# Altium project bga_fast_v2.0.PrjPcb (part 2 of 2)

## Sheet power.SchDoc
size A4; SheetNumber: 5; SheetTotal: 7
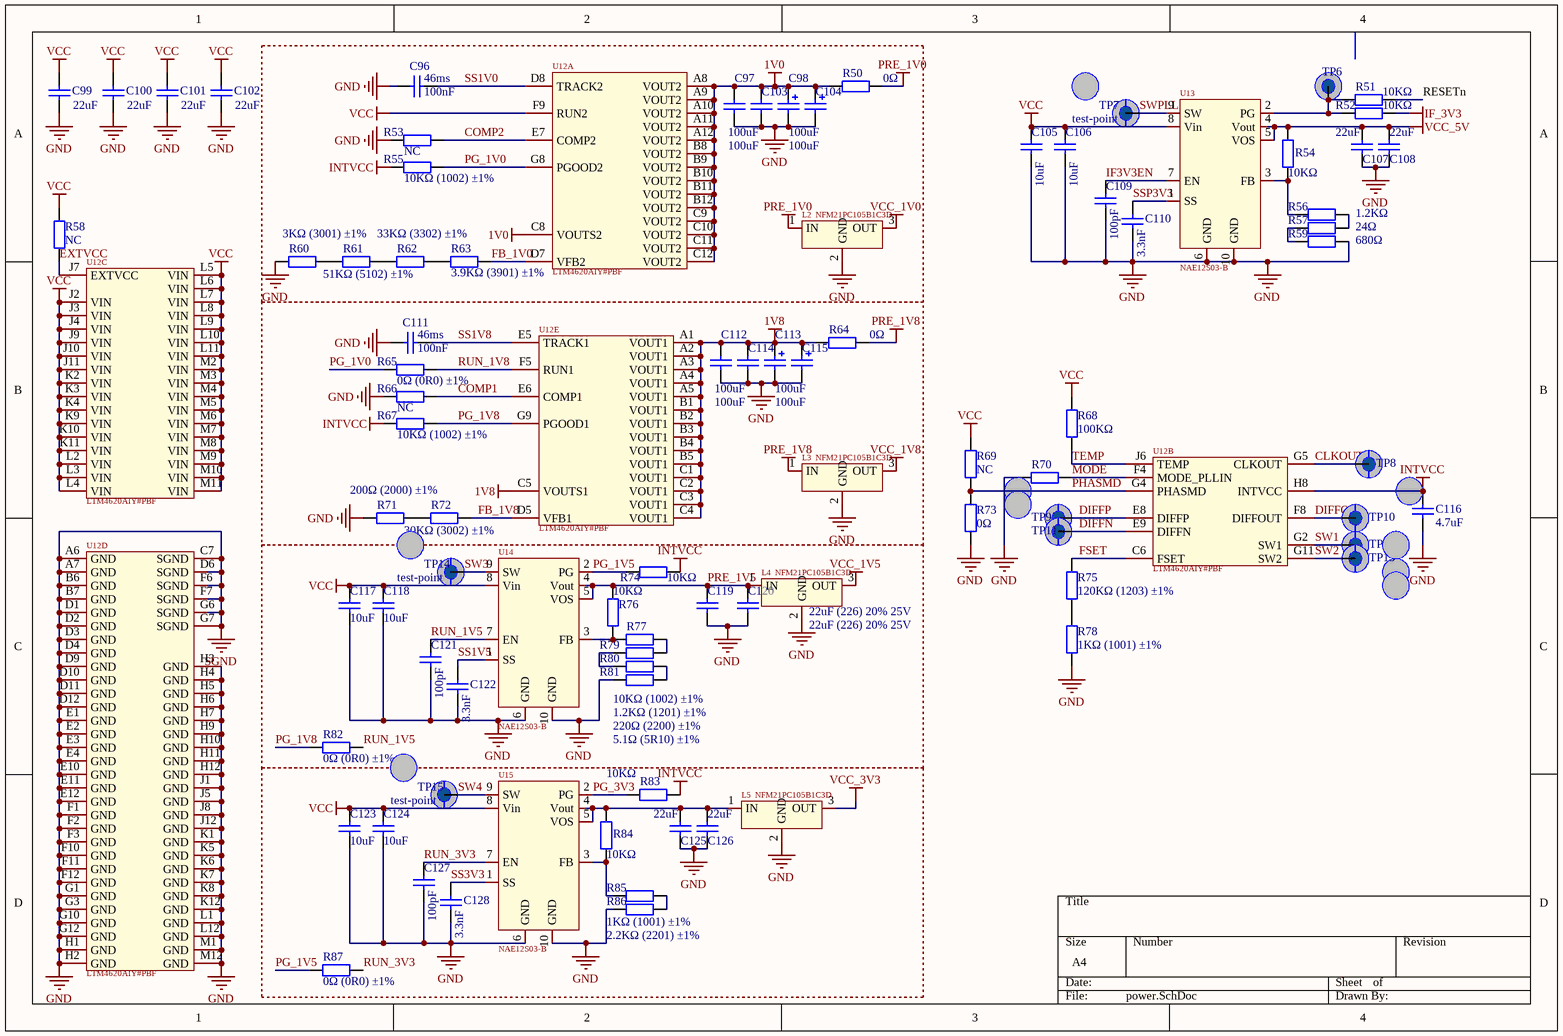
[diagram p5: power.SchDoc]

### Parts
C96  100nF  [0805_C]
C97  100uF  [1206_C]
C98  100uF  [CASE-B_3528]
C99  22uF  [0805_C]
C100  22uF  [0805_C]
C101  22uF  [0805_C]
C102  22uF  [0805_C]
C103  100uF  [1206_C]
C104  100uF  [CASE-B_3528]
C105  10uF  [0805_C]
C106  10uF  [0805_C]
C107  22uF  [0805_C]
C108  22uF  [0805_C]
C109  100pF  [0805_C]
C110  3.3nF  [0805_C]
C111  100nF  [0805_C]
C112  100uF  [1206_C]
C113  100uF  [CASE-B_3528]
C114  100uF  [1206_C]
C115  100uF  [CASE-B_3528]
C116  4.7uF  [0805_C]
C117  10uF  [0805_C]
C118  10uF  [0805_C]
C119  22uF (226) 20% 25V  [0805_C]
C120  22uF (226) 20% 25V  [0805_C]
C121  100pF  [0805_C]
C122  3.3nF  [0805_C]
C123  10uF  [0805_C]
C124  10uF  [0805_C]
C125  22uF  [0805_C]
C126  22uF  [0805_C]
C127  100pF  [0805_C]
C128  3.3nF  [0805_C]
L2  NFM21PC105B1C3D  [FILTER-SMD_3P-L2.0-W1.2-L]
L3  NFM21PC105B1C3D  [FILTER-SMD_3P-L2.0-W1.2-L]
L4  NFM21PC105B1C3D  [FILTER-SMD_3P-L2.0-W1.2-L]
L5  NFM21PC105B1C3D  [FILTER-SMD_3P-L2.0-W1.2-L]
R50  0Ω  [0402_R]
R51  10KΩ  [0805_R]
R52  10KΩ  [0805_R]
R53  NC  [0805_R]
R54  10KΩ  [0805_R]
R55  10KΩ (1002) ±1%  [0805_R]
R56  1.2KΩ  [0805_R]
R57  24Ω  [0805_R]
R58  NC  [0805_R]
R59  680Ω  [0805_R]
R60  3KΩ (3001) ±1%  [0805_R]
R61  51KΩ (5102) ±1%  [0805_R]
R62  33KΩ (3302) ±1%  [0805_R]
R63  3.9KΩ (3901) ±1%  [0805_R]
R64  0Ω  [0402_R]
R65  0Ω (0R0) ±1%  [0805_R]
R66  NC  [0805_R]
R67  10KΩ (1002) ±1%  [0805_R]
R68  100KΩ  [0805_R]
R69  NC  [0805_R]
R70  0Ω  [0805_R]
R71  200Ω (2000) ±1%  [0805_R]
R72  30KΩ (3002) ±1%  [0805_R]
R73  0Ω  [0805_R]
R74  10KΩ  [0805_R]
R75  120KΩ (1203) ±1%  [0805_R]
R76  10KΩ  [0805_R]
R77  10KΩ (1002) ±1%  [0805_R]
R78  1KΩ (1001) ±1%  [0805_R]
R79  1.2KΩ (1201) ±1%  [0805_R]
R80  220Ω (2200) ±1%  [0805_R]
R81  5.1Ω (5R10) ±1%  [0805_R]
R82  0Ω (0R0) ±1%  [0805_R]
R83  10KΩ  [0805_R]
R84  10KΩ  [0805_R]
R85  2.2KΩ (2201) ±1%  [0805_R]
R86  1KΩ (1001) ±1%  [0805_R]
R87  0Ω (0R0) ±1%  [0805_R]
TP6  test-point  [POINT]  (value not drawn)
TP7  test-point  [POINT]
TP8  test-point  [POINT]  (value not drawn)
TP9  test-point  [POINT]  (value not drawn)
TP10  test-point  [POINT]  (value not drawn)
TP11  test-point  [POINT]  (value not drawn)
TP12  test-point  [POINT]  (value not drawn)
TP13  test-point  [POINT]  (value not drawn)
TP14  test-point  [POINT]
TP15  test-point  [POINT]
U12  LTM4620AIY#PBF  [BGA-144_L15.0-W15.0-R12-C12-P1.27-BL]  (parts A,B,C,D,E of 5)
U13  NAE12S03-B  [PWRM-SMD_HUAWEI_NAE12S03]
U14  NAE12S03-B  [PWRM-SMD_HUAWEI_NAE12S03]
U15  NAE12S03-B  [PWRM-SMD_HUAWEI_NAE12S03]

### Blocks framed on the sheet
46ms: C96-C98 C103 C104 L2 R50 R53 R55 R60-R63 U12
46ms: C111-C115 L3 R64-R67 R71 R72 U12

### Nets
1V0: C97.2 C98.1 C103.2 C104.1 R50.1 U12.A8(VOUT2) U12.A9(VOUT2) U12.A10(VOUT2) U12.A11(VOUT2) U12.A12(VOUT2) U12.B8(VOUT2) U12.B9(VOUT2) U12.B10(VOUT2) U12.B11(VOUT2) U12.B12(VOUT2) U12.C8(VOUTS2) U12.C9(VOUT2) U12.C10(VOUT2) U12.C11(VOUT2) U12.C12(VOUT2)
1V8: C112.2 C113.1 C114.2 C115.1 R64.1 U12.A1(VOUT1) U12.A2(VOUT1) U12.A3(VOUT1) U12.A4(VOUT1) U12.A5(VOUT1) U12.B1(VOUT1) U12.B2(VOUT1) U12.B3(VOUT1) U12.B4(VOUT1) U12.B5(VOUT1) U12.C1(VOUT1) U12.C2(VOUT1) U12.C3(VOUT1) U12.C4(VOUT1) U12.C5(VOUTS1)
GND: C96.2 C97.1 C98.2 C99.1 C100.1 C101.1 C102.1 C103.1 C104.2 C105.1 C106.1 C107.1 C108.1 C109.1 C110.1 C111.2 C112.1 C113.2 C114.1 C115.2 C116.1 C117.1 C118.1 C119.1 C120.1 C121.1 C122.1 C123.1 C124.1 C125.1 C126.1 C127.1 C128.1 L2.2(GND) L3.2(GND) L4.2(GND) L5.2(GND) R53.1 R59.2 R60.2 R66.1 R70.2 R71.1 R73.1 R78.1 R81.2 R86.2 U12.A6(GND) U12.A7(GND) U12.B6(GND) U12.B7(GND) U12.C7(SGND) U12.D1(GND) U12.D2(GND) U12.D3(GND) U12.D4(GND) U12.D6(SGND) U12.D9(GND) U12.D10(GND) U12.D11(GND) U12.D12(GND) U12.E1(GND) U12.E2(GND) U12.E3(GND) U12.E4(GND) U12.E10(GND) U12.E11(GND) U12.E12(GND) U12.F1(GND) U12.F2(GND) U12.F3(GND) U12.F6(SGND) U12.F7(SGND) U12.F10(GND) U12.F11(GND) U12.F12(GND) U12.G1(GND) U12.G3(GND) U12.G6(SGND) U12.G7(SGND) U12.G10(GND) U12.G12(GND) U12.H1(GND) U12.H2(GND) U12.H3(GND) U12.H4(GND) U12.H5(GND) U12.H6(GND) U12.H7(GND) U12.H9(GND) U12.H10(GND) U12.H11(GND) U12.H12(GND) U12.J1(GND) U12.J5(GND) U12.J8(GND) U12.J12(GND) U12.K1(GND) U12.K5(GND) U12.K6(GND) U12.K7(GND) U12.K8(GND) U12.K12(GND) U12.L1(GND) U12.L12(GND) U12.M1(GND) U12.M12(GND) U13.6(GND) U13.10(GND) U14.6(GND) U14.10(GND) U15.6(GND) U15.10(GND)  [also labelled SGND]
IF_3V3: R52.1
INTVCC: C116.2 R55.2 R67.2 R74.2 R83.2 U12.H8(INTVCC)
PRE_1V0: L2.1(IN) R50.2
PRE_1V8: L3.1(IN) R64.2
VCC: C99.2 C100.2 C101.2 C102.2 C105.2 C106.2 C117.2 C118.2 C123.2 C124.2 R58.1 R68.2 R69.2 U12.F9(RUN2) U12.J2(VIN) U12.J3(VIN) U12.J4(VIN) U12.J9(VIN) U12.J10(VIN) U12.J11(VIN) U12.K2(VIN) U12.K3(VIN) U12.K4(VIN) U12.K9(VIN) U12.K10(VIN) U12.K11(VIN) U12.L2(VIN) U12.L3(VIN) U12.L4(VIN) U12.L5(VIN) U12.L6(VIN) U12.L7(VIN) U12.L8(VIN) U12.L9(VIN) U12.L10(VIN) U12.L11(VIN) U12.M2(VIN) U12.M3(VIN) U12.M4(VIN) U12.M5(VIN) U12.M6(VIN) U12.M7(VIN) U12.M8(VIN) U12.M9(VIN) U12.M10(VIN) U12.M11(VIN) U13.8(Vin) U14.8(Vin) U15.8(Vin)
VCC_1V0: L2.3(OUT)
VCC_1V5: L4.3(OUT)
VCC_1V8: L3.3(OUT)
VCC_3V3: L5.3(OUT)
VCC_5V: C107.2 C108.2 R54.2 U13.4(Vout) U13.5(VOS)
CLKOUT: TP8.1(point) U12.G5(CLKOUT)
COMP1: R66.2 U12.E6(COMP1)
COMP2: R53.2 U12.E7(COMP2)
DIFFN: TP11.1(point) U12.E9(DIFFN)
DIFFO: TP10.1(point) U12.F8(DIFFOUT)
DIFFP: TP9.1(point) U12.E8(DIFFP)
EXTVCC: R58.2 U12.J7(EXTVCC)
FB_1V0: R63.2 U12.D7(VFB2)
FB_1V8: R72.2 U12.D5(VFB1)
FSET: R75.2 U12.C6(FSET)
IF3V3EN: C109.2 U13.7(EN)
MODE: R70.1 U12.F4(MODE_PLLIN)
PG_1V0: R55.1 R65.2 U12.G8(PGOOD2)
PG_1V5: R74.1 R87.2 U14.2(PG)
PG_1V8: R67.1 R82.2 U12.G9(PGOOD1)
PG_3V3: R83.1 U15.2(PG)
PHASMD: R69.1 R73.2 U12.G4(PHASMD)
PRE_1V5: C119.2 C120.2 L4.1(IN) R76.2 U14.4(Vout) U14.5(VOS)
RESETn: R51.1
RUN_1V5: C121.2 R82.1 U14.7(EN)
RUN_1V8: R65.1 U12.F5(RUN1)
RUN_3V3: C127.2 R87.1 U15.7(EN)
SS1V0: C96.1 U12.D8(TRACK2)
SS1V5: C122.2 U14.1(SS)
SS1V8: C111.1 U12.E5(TRACK1)
SS3V3: C128.2 U15.1(SS)
SSP3V3: C110.2 U13.1(SS)
SW1: TP12.1(point) U12.G2(SW1)
SW2: TP13.1(point) U12.G11(SW2)
SW3: TP14.1(point) U14.9(SW)
SW4: TP15.1(point) U15.9(SW)
SWPLL: TP7.1(point) U13.9(SW)
TEMP: R68.1 U12.J6(TEMP)
NetC125_2: C125.2 C126.2 L5.1(IN) R84.2 U15.4(Vout) U15.5(VOS)
NetR51_2: R51.2 R52.2 TP6.1(point) U13.2(PG)
NetR54_1: R54.1 R56.1 U13.3(FB)
NetR56_2: R56.2 R57.2
NetR57_1: R57.1 R59.1
NetR60_1: R60.1 R61.1
NetR61_2: R61.2 R62.1
NetR62_2: R62.2 R63.1
NetR71_2: R71.2 R72.1
NetR75_1: R75.1 R78.2
NetR76_1: R76.1 R77.1 U14.3(FB)
NetR77_2: R77.2 R79.1
NetR79_2: R79.2 R80.2
NetR80_1: R80.1 R81.1
NetR84_1: R84.1 R85.1 U15.3(FB)
NetR85_2: R85.2 R86.1

### Library data of the parts
C96 C111 = 0805 100nF(104) 10% 50V: 贴片电容; ComponentLink1Description: 供应商链接; ComponentLink1URL: http://www.szlcsc.com/product/details_50686.html; Package: 0805; Supplier: LC; SuppliersPartNumber: C49678
C97 C103 C112 C114 = 1206 100nF (104) 10% 50V: 贴片电容; ComponentLink1Description: 供应商链接; ComponentLink1URL: http://www.szlcsc.com/product/details_25237.html; Package: 1206; Supplier: LC; SuppliersPartNumber: C24497
C98 C104 C113 C115 = 3528 100uF (107) 10% 6.3V: 钽电容; ComponentLink1Description: 供应商链接; ComponentLink1URL: http://www.szlcsc.com/product/details_16815.html; Package: 3528; Supplier: LC; SuppliersPartNumber: C16133
C99-C102 C107 C108 C119 C120 C125 C126 = 0805 22uF (226) 20% 25V: 贴片电容; ComponentLink1Description: 供应商链接; ComponentLink1URL: http://www.szlcsc.com/product/details_46786.html; Package: 0805; Supplier: LC; SuppliersPartNumber: C45783
C105 C106 C117 C118 C123 C124 = 0805 10uF (106) 10% 25V: 贴片电容; ComponentLink1Description: 供应商链接; ComponentLink1URL: http://www.szlcsc.com/product/details_16532.html; Package: 0805; Supplier: LC; SuppliersPartNumber: C15850
C109 C121 C127 = 0805 100pF (101) 5% 50V: 贴片电容; ComponentLink1Description: 供应商链接; ComponentLink1URL: http://www.szlcsc.com/product/details_2142.html; Package: 0805; Supplier: LC; SuppliersPartNumber: C1790
C110 C122 C128 = 0805 3.3nF (332) 10% 50V: 贴片电容; ComponentLink1Description: 供应商链接; ComponentLink1URL: http://www.szlcsc.com/product/details_54191.html; Package: 0805; Supplier: LC; SuppliersPartNumber: C53175
C116 = 0805 4.7uF (475) 10% 25V: 贴片电容; ComponentLink1Description: 供应商链接; ComponentLink1URL: http://www.szlcsc.com/product/details_2131.html; Package: 0805; Supplier: LC; SuppliersPartNumber: C1779
L2-L5 = NFM21PC105B1C3D: 穿心电容; Manufacturer: muRata(村田); Add into BOM: yes; Nominal Capacitance: 1uF; CapacitanceTolerance: ±20%; DC Rated Voltage: 16V; Rated Current: 4A; DC Resistance: 20mΩ; Symbol: NFM21PC105B1C3D; Device: NFM21PC105B1C3D; LCSC Part Name: 1.0uF(105) ±20%16V; Supplier Part: C92518; Manufacturer Part: NFM21PC105B1C3D; Supplier Footprint: SMD-3P,1.2x2mm; JLCPCB Part Class: Extended Part; Datasheet: https://atta.szlcsc.com/upload/public/pdf/source/20170105/1483610797228.pdf; Supplier: LCSC; Convert to PCB: yes; Operating Temperature: -40℃~+85℃
R50 R64 R65 R69 R70 R73 R82 R87 = 0805 0Ω (0R0) 1%: 贴片电阻; ComponentLink1Description: 供应商链接; ComponentLink1URL: http://www.szlcsc.com/product/details_18165.html; Package: 0805; Supplier: LC; SuppliersPartNumber: C17477
R51 R52 R54 R55 R67 R74 R76 R77 R83 R84 = 0805 10KΩ (1002) 1%: 贴片电阻; ComponentLink1Description: 供应商链接; ComponentLink1URL: http://www.szlcsc.com/product/details_18102.html; Package: 0805; Supplier: LC; SuppliersPartNumber: C17414
R53 R62 R66 R72 = 0805 33KΩ (3302) 1%: 贴片电阻; ComponentLink1Description: 供应商链接; ComponentLink1URL: http://www.szlcsc.com/product/details_18321.html; Package: 0805; Supplier: LC; SuppliersPartNumber: C17633
R56 R85 = 0805 2.2KΩ (2201) 1%: 贴片电阻; ComponentLink1Description: 供应商链接; ComponentLink1URL: http://www.szlcsc.com/product/details_18208.html; Package: 0805; Supplier: LC; SuppliersPartNumber: C17520
R57 R59 R86 = 0805 1KΩ (1001) 1%: 贴片电阻; ComponentLink1Description: 供应商链接; ComponentLink1URL: http://www.szlcsc.com/product/details_18201.html; Package: 0805; Supplier: LC; SuppliersPartNumber: C17513
R58 R60 = 0805 3KΩ (3001) 1%: 贴片电阻; ComponentLink1Description: 供应商链接; ComponentLink1URL: http://www.szlcsc.com/product/details_18349.html; Package: 0805; Supplier: LC; SuppliersPartNumber: C17661
R61 = 0805 51KΩ (5102) 1%: 贴片电阻; ComponentLink1Description: 供应商链接; ComponentLink1URL: http://www.szlcsc.com/product/details_18425.html; Package: 0805; Supplier: LC; SuppliersPartNumber: C17737
R63 = 0805 3.9KΩ (3901) 1%: 贴片电阻; ComponentLink1Description: 供应商链接; ComponentLink1URL: http://www.szlcsc.com/product/details_18302.html; Package: 0805; Supplier: LC; SuppliersPartNumber: C17614
R68 = 0805 100KΩ (1003) 1%: 贴片电阻; ComponentLink1Description: 供应商链接; ComponentLink1URL: http://www.szlcsc.com/product/details_18095.html; Package: 0805; Supplier: LC; SuppliersPartNumber: C17407
R71 = 0805 200Ω (2000) 1%: 贴片电阻; ComponentLink1Description: 供应商链接; ComponentLink1URL: http://www.szlcsc.com/product/details_18228.html; Package: 0805; Supplier: LC; SuppliersPartNumber: C17540
R75 = 0402 120KΩ (1203) 1%: 贴片电阻; ComponentLink1Description: 供应商链接; ComponentLink1URL: http://www.szlcsc.com/product/details_26493.html; Package: 0402; Supplier: LC; SuppliersPartNumber: C25750
R78 = 0402 1KΩ (1001) 1%: 贴片电阻; ComponentLink1Description: 供应商链接; ComponentLink1URL: http://www.szlcsc.com/product/details_12256.html; Package: 0402; Supplier: LC; SuppliersPartNumber: C11702
R79 = 0805 1.2KΩ (1201) 1%: 贴片电阻; ComponentLink1Description: 供应商链接; ComponentLink1URL: http://www.szlcsc.com/product/details_18067.html; Package: 0805; Supplier: LC; SuppliersPartNumber: C17379
R80 = 0805 220Ω (2200) 1%: 贴片电阻; ComponentLink1Description: 供应商链接; ComponentLink1URL: http://www.szlcsc.com/product/details_18245.html; Package: 0805; Supplier: LC; SuppliersPartNumber: C17557
R81 = 0805 5.1Ω (5R10) 1%: 贴片电阻; ComponentLink1Description: 供应商链接; ComponentLink1URL: http://www.szlcsc.com/product/details_18412.html; Package: 0805; Supplier: LC; SuppliersPartNumber: C17724
TP6-TP15 = test-point: 测试点
U12 = LTM4620AIY#PBF: ADI电源; Manufacturer: ADI(亚德诺); Add into BOM: yes; Conversion Type: DC-DC; Input Voltage(DC): 4.5V~16V; Output Voltage: 0.6V~5.3V; Output Current (Max): 13A; Output Channel: 2; Symbol: LTM4620AIY#PBF; Device: LTM4620AIY#PBF; LCSC Part Name: 双通道 13A 或单通道 26A DC/DC uModule 稳压器; Supplier Part: C108015; Manufacturer Part: LTM4620AIY#PBF; Supplier Footprint: BGA-144(15x15); JLCPCB Part Class: Extended Part; Datasheet: https://atta.szlcsc.com/upload/public/pdf/source/20191223/C471410_9980ECA8DA2BC0F921CA49592D580556.pdf; Supplier: LCSC; Convert to PCB: yes; Output Power: -; Insulated Voltage: -; Conversion Efficiency: -; Feature: 过压保护；欠压保护；过流保护; Maximum Capacitive Load: -
U13-U15 = NAE12S03-B: 华为电源模块; Manufacturer: HUAWEI(华为); Add into BOM: yes; Conversion Type: DC-DC; Input Voltage(DC): 6.3V~14V; Output Voltage: 0.8V~5.2V; Output Power: 15W; Output Current (Max): 3A; Output Channel: 1; Maximum Capacitive Load: 500uF; Symbol: NAE12S03-B; Device: NAE12S03-B; LCSC Part Name: NAE12S03-B; Supplier Part: C5632472; Manufacturer Part: NAE12S03-B; Supplier Footprint: -; JLCPCB Part Class: Extended Part; Datasheet: https://atta.szlcsc.com/upload/public/pdf/source/20230428/342BA0ED97D448F86BA8DB326342F56D.pdf; Supplier: LCSC; Convert to PCB: yes

## Sheet Risc_V.SchDoc
size A4; SheetNumber: 6; SheetTotal: 7
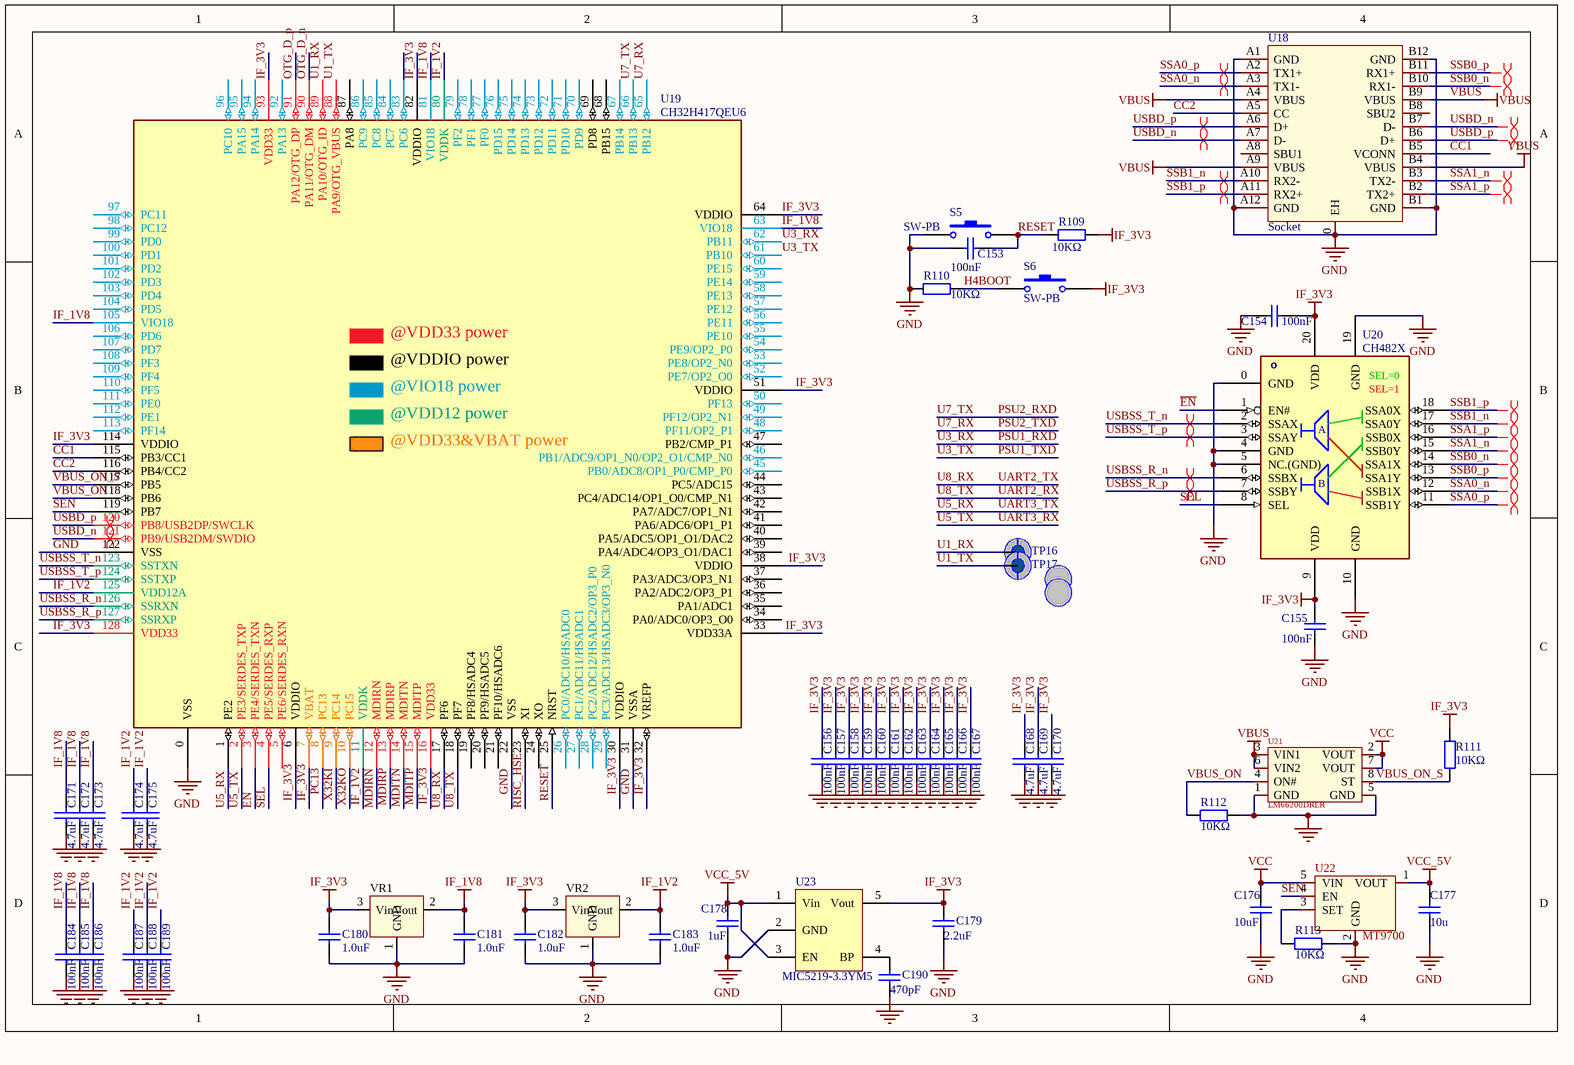
[diagram p6: Risc_V.SchDoc]

### Parts
C153  100nF  [0805_C]
C154  100nF  [0201]
C155  100nF  [0201]
C156  100nF  [0201]
C157  100nF  [0201]
C158  100nF  [0201]
C159  100nF  [0201]
C160  100nF  [0201]
C161  100nF  [0201]
C162  100nF  [0201]
C163  100nF  [0201]
C164  100nF  [0201]
C165  100nF  [0201]
C166  100nF  [0201]
C167  100nF  [0201]
C168  4.7uF  [0805_C]
C169  4.7uF  [0805_C]
C170  4.7uF  [0805_C]
C171  4.7uF  [0805_C]
C172  4.7uF  [0805_C]
C173  4.7uF  [0805_C]
C174  4.7uF  [0805_C]
C175  4.7uF  [0805_C]
C176  10uF  [0805_C]
C177  10u  [0805_C]
C178  1uF  [0805_C]
C179  2.2uF  [0805_C]
C180  1.0uF  [0805_C]
C181  1.0uF  [0805_C]
C182  1.0uF  [0805_C]
C183  1.0uF  [0805_C]
C184  100nF  [0201]
C185  100nF  [0201]
C186  100nF  [0201]
C187  100nF  [0201]
C188  100nF  [0201]
C189  100nF  [0201]
C190  470pF  [0805_C]
R109  10KΩ  [0805_R]
R110  10KΩ  [0805_R]
R111  10KΩ  [0805_R]
R112  10KΩ  [0201]
R113  10KΩ  [0805_R]
S5  SW-PB  [SW-3*4-2P]
S6  SW-PB  [SW-3*4-2P]
TP16  test-point  [POINT]  (value not drawn)
TP17  test-point  [POINT]  (value not drawn)
U18  Socket  [USB Type C 24pin全后贴]
U19  CH32H417QEU6  [QFN128_12.3X12.3]
U20  CH482X  [QFN20_2.5X4.5]
U21  LM66200DRLR  [SOT-583-8_L2.1-W1.2-P0.50-LS1.6-BL]
U22  MT9700  [SOT-23-5]
U23  MIC5219-3.3YM5  [SOT-23-5]
VR1  XC6206P332MR-G  [SOT-23-3_L2.9-W1.6-P1.90-LS2.8-BR]  (value not drawn)
VR2  XC6206P332MR-G  [SOT-23-3_L2.9-W1.6-P1.90-LS2.8-BR]  (value not drawn)

### Nets
GND: C153.1 C154.2 C155.1 C156.2 C157.1 C158.2 C159.2 C160.1 C161.2 C162.1 C163.2 C164.2 C165.1 C166.1 C167.1 C168.2 C169.2 C170.2 C171.2 C172.1 C173.2 C174.2 C175.1 C176.1 C177.1 C178.1 C179.1 C180.1 C181.1 C182.1 C183.1 C184.1 C185.1 C186.2 C187.1 C188.1 C189.1 C190.1 R110.1 R112.1 R113.1 S5.1 U18.0(EH) U18.A1(GND) U18.A12(GND) U18.B1(GND) U18.B12(GND) U19.0(VSS) U19.22(VSS) U19.31(VSSA) U19.122(VSS) U20.0(GND) U20.4(GND) U20.5(NC.(GND)) U20.10(GND) U20.19(GND) U21.1(GND) U21.5(GND) U22.2(GND) U23.2(GND) VR1.1(GND) VR2.1(GND)
IF_1V2: C174.1 C175.2 C183.2 C187.2 C188.2 C189.2 U19.11(VDDK) U19.80(VDDK) U19.125(VDD12A) VR2.2(Vout)
IF_1V8: C171.1 C172.2 C173.1 C181.2 C184.2 C185.2 C186.1 U19.63(VIO18) U19.81(VIO18) U19.105(VIO18) VR1.2(Vout)
IF_3V3: C154.1 C155.2 C156.1 C157.2 C158.1 C159.1 C160.2 C161.1 C162.2 C163.1 C164.1 C165.2 C166.2 C167.2 C168.1 C169.1 C170.1 C179.2 C180.2 C182.2 R109.2 R111.2 S6.2 U19.6(VDDIO) U19.7(VBAT) U19.16(VDD33) U19.30(VDDIO) U19.32(VREFP) U19.33(VDD33A) U19.38(VDDIO) U19.51(VDDIO) U19.64(VDDIO) U19.82(VDDIO) U19.93(VDD33) U19.114(VDDIO) U19.128(VDD33) U20.9(VDD) U20.20(VDD) U23.5(Vout) VR1.3(Vin) VR2.3(Vin)
VBUS: U18.A4(VBUS) U18.A9(VBUS) U18.B4(VBUS) U18.B9(VBUS) U21.3(VIN1) U21.6(VIN2)
VCC: C176.2 U21.2(VOUT) U21.7(VOUT) U22.5(VIN)
VCC_5V: C177.2 C178.2 U22.1(VOUT) U23.1(Vin) U23.3(EN)
CC1: U18.B5(VCONN) U19.115(PB3/CC1)
CC2: U18.A5(CC) U19.116(PB4/CC2)
~{EN}: U19.3(PE4/SERDES_TXN) U20.1(EN#)
H4BOOT: R110.2 S6.1
MDIRN: U19.12(MDIRN)
MDIRP: U19.13(MDIRP)
MDITN: U19.14(MDITN)
MDITP: U19.15(MDITP)
OTG_D_n: U19.90(PA11/OTG_DM)
OTG_D_p: U19.91(PA12/OTG_DP)
PC13: U19.8(PC13)
PSU1_RXD: U19.62(PB11)  [also labelled U3_RX]
PSU1_TXD: U19.61(PB10)  [also labelled U3_TX]
PSU2_RXD: U19.66(PB13)  [also labelled U7_TX]
PSU2_TXD: U19.65(PB12)  [also labelled U7_RX]
RESET: C153.2 R109.1 S5.2 U19.25(NRST)
RISC_HSE: U19.23(XI)
SEL: U19.4(PE5/SERDES_RXP) U20.8(SEL)
SEN: U19.119(PB7) U22.4(EN)
SSA0_n: U18.A3(TX1-) U20.12(SSB1X)
SSA0_p: U18.A2(TX1+) U20.11(SSB1Y)
SSA1_n: U18.B3(TX2-) U20.15(SSB0Y)
SSA1_p: U18.B2(TX2+) U20.16(SSB0X)
SSB0_n: U18.B10(RX1-) U20.14(SSA1X)
SSB0_p: U18.B11(RX1+) U20.13(SSA1Y)
SSB1_n: U18.A10(RX2-) U20.17(SSA0Y)
SSB1_p: U18.A11(RX2+) U20.18(SSA0X)
U1_RX: TP16.1(point) U19.89(PA10/OTG_ID)
U1_TX: TP17.1(point) U19.88(PA9/OTG_VBUS)
U5_RX: U19.1(PE2)  [also labelled UART3_TX]
U5_TX: U19.2(PE3/SERDES_TXP)  [also labelled UART3_RX]
U8_RX: U19.17(PF6)  [also labelled UART2_TX]
U8_TX: U19.18(PF7)  [also labelled UART2_RX]
USBD_n: U18.A7(D-) U18.B7(D-) U19.121(PB9/USB2DM/SWDIO)
USBD_p: U18.A6(D+) U18.B6(D+) U19.120(PB8/USB2DP/SWCLK)
USBSS_R_n: U19.126(SSRXN) U20.6(SSBX)
USBSS_R_p: U19.127(SSRXP) U20.7(SSBY)
USBSS_T_n: U19.123(SSTXN) U20.2(SSAX)
USBSS_T_p: U19.124(SSTXP) U20.3(SSAY)
VBUS_ON: R112.2 U19.118(PB6) U21.4(ON#)
VBUS_ON_S: R111.1 U19.117(PB5) U21.8(ST)
X32KI: U19.9(PC14)
X32KO: U19.10(PC15)
NetC190_2: C190.2 U23.4(BP)
NetR113_2: R113.2 U22.3(SET)

Not connected (* = marked no-connect by the designer): U18 A8(SBU1) B8(SBU2); U19 5(PE6/SERDES_RXN) 19(PF8/HSADC4) 20(PF9/HSADC5) 21(PF10/HSADC6) 24(XO) 26(PC0/ADC10/HSADC0) 27(PC1/ADC11/HSADC1) 28(PC2/ADC12/HSADC2/OP3_P0) 29(PC3/ADC13/HSADC3/OP3_N0) 34(PA0/ADC0/OP3_O0) 35(PA1/ADC1) 36(PA2/ADC2/OP3_P1) 37(PA3/ADC3/OP3_N1) 39(PA4/ADC4/OP3_O1/DAC1) 40(PA5/ADC5/OP1_O1/DAC2) 41(PA6/ADC6/OP1_P1) 42(PA7/ADC7/OP1_N1) 43(PC4/ADC14/OP1_O0/CMP_N1) 44(PC5/ADC15) 45(PB0/ADC8/OP1_P0/CMP_P0) 46(PB1/ADC9/OP1_N0/OP2_O1/CMP_N0) 47(PB2/CMP_P1) 48(PF11/OP2_P1) 49(PF12/OP2_N1) 50(PF13) 52(PE7/OP2_O0) 53(PE8/OP2_N0) 54(PE9/OP2_P0) 55(PE10) 56(PE11) 57(PE12) 58(PE13) 59(PE14) 60(PE15) 67(PB14) 68(PB15) 69(PD8) 70(PD9) 71(PD10) 72(PD11) 73(PD12) 74(PD13) 75(PD14) 76(PD15) 77(PF0) 78(PF1) 79(PF2) 83(PC6) 84(PC7) 85(PC8) 86(PC9) 87(PA8) 92(PA13) 94(PA14) 95(PA15) 96(PC10) 97(PC11) 98(PC12) 99(PD0) 100(PD1) 101(PD2) 102(PD3) 103(PD4) 104(PD5) 106(PD6) 107(PD7) 108(PF3) 109(PF4) 110(PF5) 111(PE0) 112(PE1) 113(PF14)

### Layout directives
differential pair: SSA0_n, SSA0_p, SSA1_n, SSA1_p, SSB0_n, SSB0_p, SSB1_n, SSB1_p, USBD_n, USBD_p, USBSS_R_n, USBSS_R_p, USBSS_T_n, USBSS_T_p

### Notes on the sheet
- (in symbol CH32H417QET6) @VDD33 power; @VDDIO power; @VIO18 power; @VDD12 power; @VDD33&VBAT power
- (in symbol CH482X) o; SEL=0; SEL=1; A; B

### Library data of the parts
C153-C167 C184-C189 = 0402 100nF (104) 10% 16V: 贴片电容; ComponentLink1Description: 供应商链接; ComponentLink1URL: http://www.szlcsc.com/product/details_1877.html; Package: 0402; Supplier: LC; SuppliersPartNumber: C1525
C168-C175 = CAP: Capacitor
C176 C177 = 0805 10uF (106) 10% 25V: 贴片电容; ComponentLink1Description: 供应商链接; ComponentLink1URL: http://www.szlcsc.com/product/details_16532.html; Package: 0805; Supplier: LC; SuppliersPartNumber: C15850
C178 C179 C190 = 0805 1uF (105) 10% 50V: 贴片电容; ComponentLink1Description: 供应商链接; ComponentLink1URL: http://www.szlcsc.com/product/details_29074.html; Package: 0805; Supplier: LC; SuppliersPartNumber: C28323
C180-C183 = 0402 1.0uF (105) 10% 25V: 贴片电容; ComponentLink1Description: 供应商链接; ComponentLink1URL: http://www.szlcsc.com/product/details_53938.html; Package: 0402; Supplier: LC; SuppliersPartNumber: C52923
R109 R110 = 0402 10KΩ (1002) 1%: 贴片电阻; ComponentLink1Description: 供应商链接; ComponentLink1URL: http://www.szlcsc.com/product/details_26487.html; Package: 0402; Supplier: LC; SuppliersPartNumber: C25744
R111-R113 = 0805 10KΩ (1002) 1%: 贴片电阻; ComponentLink1Description: 供应商链接; ComponentLink1URL: http://www.szlcsc.com/product/details_18102.html; Package: 0805; Supplier: LC; SuppliersPartNumber: C17414
S5 S6 = SW-PB: Switch; Published: 24-Mar-1999; LatestRevisionDate: 17-Jul-2002; LatestRevisionNote: Re-released for DXP Platform.; PackageReference: SPST-2; Publisher: Altium Limited; PackageDescription: Switch; 2 Leads
TP16 TP17 = test-point: 测试点
U18 = USB type C 沉板公头
U19 = CH32H417QET6: RISC-V FPU HD-MCU, 384MHz, USB3.0 & PD, 100M Ethernet, DVP, SDMMC, QSPI, OPA, ADC, DAC
U20 = CH482X: DP/PCIe/SATA/USB3.0/USB3.2 Differential Switch, QPDT
U21 = LM66200DRLR: 理想二极管; Manufacturer: TI(德州仪器); Add into BOM: yes; Symbol: LM66200DRLR; Device: LM66200DRLR; LCSC Part Name: LM66200DRLR; Supplier Part: C3235556; Manufacturer Part: LM66200DRLR; Supplier Footprint: SOT-583; JLCPCB Part Class: Extended Part; Datasheet: https://www.ti.com/cn/lit/gpn/lm66200; Supplier: LCSC; Convert to PCB: yes
U22 = MT9700: Manufacturer: 西安航天民芯; Add into BOM: yes; Symbol: MT9700; Device: MT9700; LCSC Part Name: MT9700 停产; Supplier Part: C89855; Manufacturer Part: MT9700; Supplier Footprint: SOT-23-5; JLCPCB Part Class: Extended Part; Datasheet: https://atta.szlcsc.com/upload/public/pdf/source/20170418/1492481333031.pdf; Supplier: LCSC; Convert to PCB: yes
U23 = RT9193-33: 3.3v低压差稳压芯片
VR1 VR2 = XC6206P332MR-G_C5446: 通用LDO; Manufacturer: TOREX(特瑞仕); Add into BOM: yes; Output Type: 固定; Voltage - Supply: 6V; Output Voltage: 3.3V; Output Current: 200mA; standby current: 1uA; Output Configuration: 正极; Number of Outputs: 1; Symbol: XC6206P332MR; Device: XC6206P332MR-G_C5446; LCSC Part Name: 输入6V 输出3.3V 200mA; Supplier Part: C5446; Manufacturer Part: XC6206P332MR-G; Supplier Footprint: SOT-23-3L; JLCPCB Part Class: Basic Part; Datasheet: https://item.szlcsc.com/datasheet/XC6206P332MR-G/5896.html; Supplier: LCSC; Convert to PCB: yes; Power Supply Rejection Ratio (PSRR): -; Voltage Dropout: -; Features: 过流保护; Operating Temperature: -40℃~+85℃@(Ta)

## Sheet AD9156.SchDoc
size A4; SheetNumber: 7; SheetTotal: 7
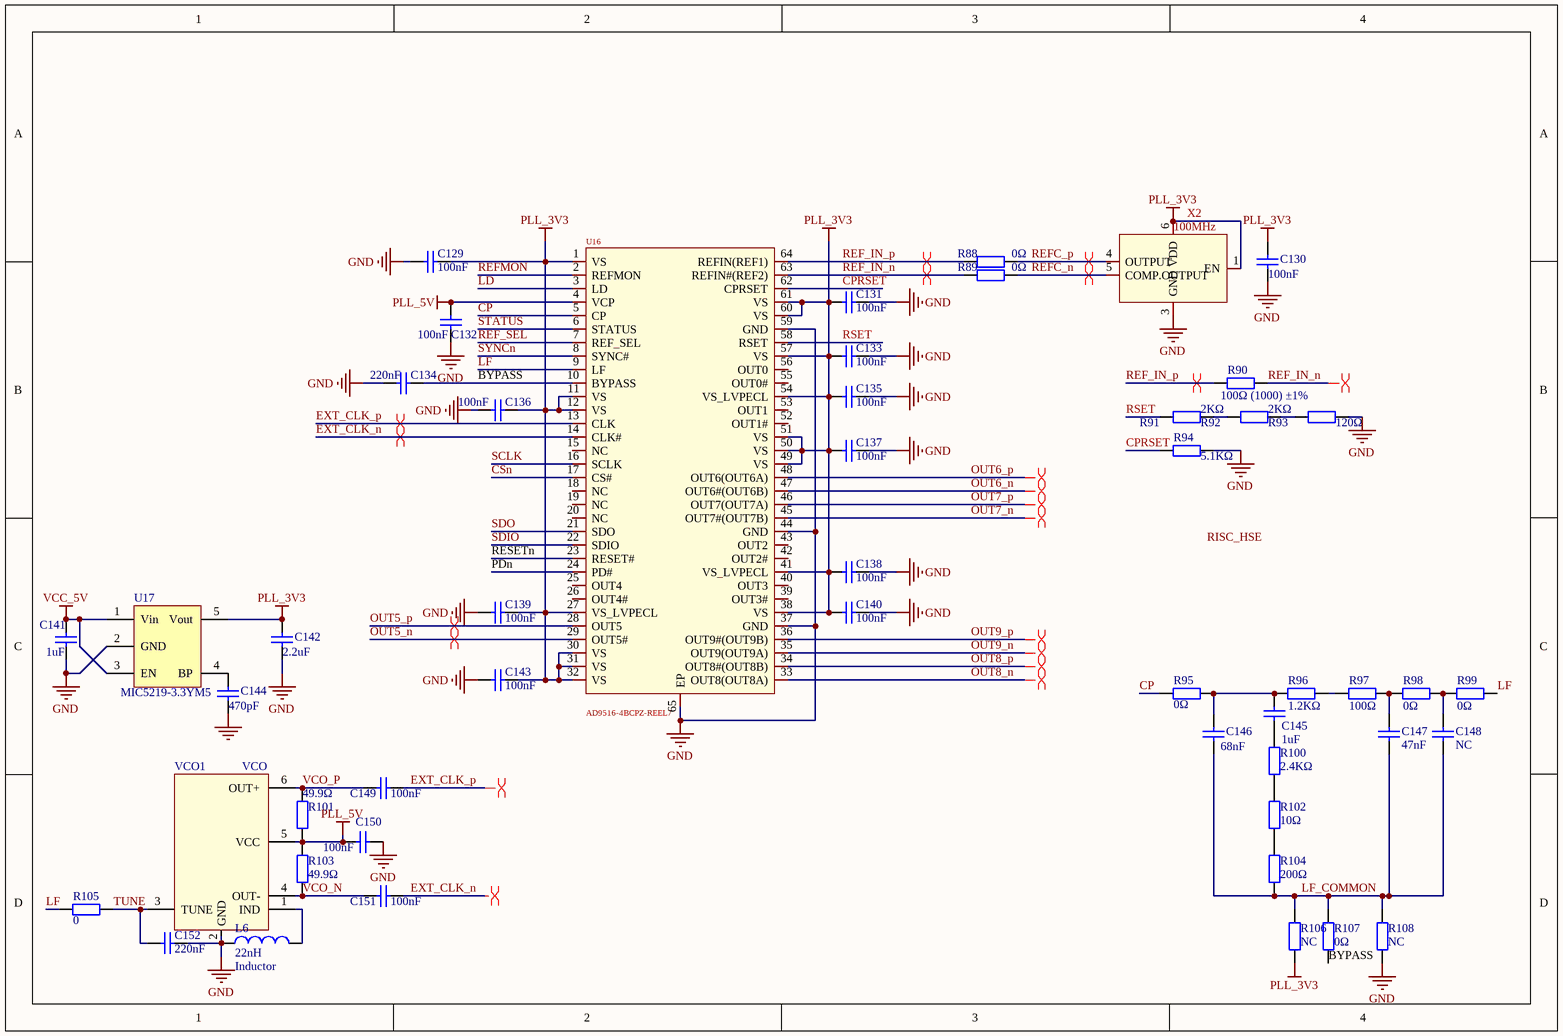
[diagram p7: AD9156.SchDoc]

### Parts
C129  100nF  [0201]
C130  100nF  [0201]
C131  100nF  [0201]
C132  100nF  [0201]
C133  100nF  [0201]
C134  220nF  [0805_C]
C135  100nF  [0201]
C136  100nF  [0201]
C137  100nF  [0201]
C138  100nF  [0201]
C139  100nF  [0201]
C140  100nF  [0201]
C141  1uF  [0805_C]
C142  2.2uF  [0805_C]
C143  100nF  [0201]
C144  470pF  [0805_C]
C145  1uF  [0805_C]
C146  68nF  [0805_C]
C147  47nF  [0805_C]
C148  NC  [0805_C]
C149  100nF  [0805_C]
C150  100nF  [0805_C]
C151  100nF  [0805_C]
C152  220nF  [0805_C]
L6  Inductor  value 22nH  [0805_L]
R88  0Ω  [0805_R]
R89  0Ω  [0805_R]
R90  100Ω (1000) ±1%  [0805_R]
R91  2KΩ  [0805_R]
R92  2KΩ  [0805_R]
R93  120Ω  [0805_R]
R94  5.1KΩ  [0805_R]
R95  0Ω  [0805_R]
R96  1.2KΩ  [0805_R]
R97  100Ω  [0805_R]
R98  0Ω  [0805_R]
R99  0Ω  [0805_R]
R100  2.4KΩ  [0805_R]
R101  49.9Ω  [0805_R]
R102  10Ω  [0805_R]
R103  49.9Ω  [0805_R]
R104  200Ω  [0805_R]
R105  0  [0805_R]
R106  NC  [0805_R]
R107  0Ω  [0805_R]
R108  NC  [0805_R]
U16  AD9516-4BCPZ-REEL7  [LFCSP-64_L9.0-W8.8-P0.50-TL-EP6.2]
U17  MIC5219-3.3YM5  [SOT-23-5]
VCO1  VCO  [SOT-23-6_L2.9-W1.6-P0.95-LS2.8-BL]
X2  100MHz  [OSC-SMD_6P-L3.2-W2.5-BL_SG3225EAN]

### Nets
GND: C129.1 C130.1 C131.2 C132.1 C133.2 C134.1 C135.1 C136.1 C137.2 C138.1 C139.1 C140.2 C141.1 C142.1 C143.1 C144.1 C150.1 C152.1 L6.1 R93.2 R94.2 R108.1 U16.37(GND) U16.44(GND) U16.59(GND) U16.65(EP) U17.2(GND) VCO1.2(GND) X2.3(GND)
PLL_3V3: C129.2 C130.2 C131.1 C133.1 C135.2 C136.2 C137.1 C138.2 C139.2 C140.1 C142.2 C143.2 R106.1 U16.1(VS) U16.11(VS) U16.12(VS) U16.27(VS_LVPECL) U16.30(VS) U16.31(VS) U16.32(VS) U16.38(VS) U16.41(VS_LVPECL) U16.49(VS) U16.50(VS) U16.51(VS) U16.54(VS_LVPECL) U16.57(VS) U16.60(VS) U16.61(VS) U17.5(Vout) X2.1(EN) X2.6(VDD)
PLL_5V: C132.2 C150.2 R101.1 R103.2 U16.4(VCP) VCO1.5(VCC)
VCC_5V: C141.2 U17.1(Vin) U17.3(EN)
BYPASS: C134.2 R107.1 U16.10(BYPASS)
CP: R95.1 U16.5(CP)
CPRSET: R94.1 U16.62(CPRSET)
CSn: U16.17(CS#)
EXT_CLK_n: C151.1 U16.14(CLK#)
EXT_CLK_p: C149.1 U16.13(CLK)
LD: U16.3(LD)
LF: R99.2 R105.2 U16.9(LF)
LF_COMMON: C146.1 C147.1 C148.1 R104.1 R106.2 R107.2 R108.2
OUT5_n: U16.29(OUT5#)
OUT5_p: U16.28(OUT5)
OUT6_n: U16.47(OUT6#(OUT6B))
OUT6_p: U16.48(OUT6(OUT6A))
OUT7_n: U16.45(OUT7#(OUT7B))
OUT7_p: U16.46(OUT7(OUT7A))
OUT8_n: U16.33(OUT8(OUT8A))
OUT8_p: U16.34(OUT8#(OUT8B))
OUT9_n: U16.35(OUT9(OUT9A))
OUT9_p: U16.36(OUT9#(OUT9B))
PDn: U16.24(PD#)
REF_IN_n: R89.1 R90.1 U16.63(REFIN#(REF2))
REF_IN_p: R88.1 R90.2 U16.64(REFIN(REF1))
REF_SEL: U16.7(REF_SEL)
REFC_n: R89.2 X2.5(COMP.OUTPUT)
REFC_p: R88.2 X2.4(OUTPUT)
REFMON: U16.2(REFMON)
RESETn: U16.23(RESET#)
RSET: R91.1 U16.58(RSET)
SCLK: U16.16(SCLK)
SDIO: U16.22(SDIO)
SDO: U16.21(SDO)
STATUS: U16.6(STATUS)
SYNCn: U16.8(SYNC#)
TUNE: C152.2 R105.1 VCO1.3(TUNE)
VCO_N: C151.2 R103.1 VCO1.4(OUT-)
VCO_P: C149.2 R101.2 VCO1.6(OUT+)
NetC144_2: C144.2 U17.4(BP)
NetC145_1: C145.1 R100.2
NetC145_2: C145.2 C146.2 R95.2 R96.1
NetC147_2: C147.2 R97.2 R98.1
NetC148_2: C148.2 R98.2 R99.1
NetL6_2: L6.2 VCO1.1(IND)
NetR91_2: R91.2 R92.1
NetR92_2: R92.2 R93.1
NetR96_2: R96.2 R97.1
NetR100_1: R100.1 R102.2
NetR102_1: R102.1 R104.2

Not connected (* = marked no-connect by the designer): U16 15(NC) 18(NC) 19(NC) 20(NC) 25(OUT4) 26(OUT4#) 39(OUT3#) 40(OUT3) 42(OUT2#) 43(OUT2) 52(OUT1#) 53(OUT1) 55(OUT0#) 56(OUT0)

### Layout directives
differential pair: EXT_CLK_n, EXT_CLK_p, OUT5_n, OUT5_p, OUT6_n, OUT6_p, OUT7_n, OUT7_p, OUT8_n, OUT8_p, OUT9_n, OUT9_p, REF_IN_n, REF_IN_p, REFC_n, REFC_p

### Notes on the sheet
- Labels drawn without touching a wire or pin: RISC_HSE

### Library data of the parts
C129-C133 C135-C140 C143 = 0402 100nF (104) 10% 16V: 贴片电容; ComponentLink1Description: 供应商链接; ComponentLink1URL: http://www.szlcsc.com/product/details_1877.html; Package: 0402; Supplier: LC; SuppliersPartNumber: C1525
C134 = 0402 220nF (224) 10% 16V: 贴片电容; ComponentLink1Description: 供应商链接; ComponentLink1URL: http://www.szlcsc.com/product/details_17456.html; Package: 0402; Supplier: LC; SuppliersPartNumber: C16772
C141 C142 C144 = 0805 1uF (105) 10% 50V: 贴片电容; ComponentLink1Description: 供应商链接; ComponentLink1URL: http://www.szlcsc.com/product/details_29074.html; Package: 0805; Supplier: LC; SuppliersPartNumber: C28323
C145 C147 C148 = 0805 47nF (473) 10% 50V: 贴片电容; ComponentLink1Description: 供应商链接; ComponentLink1URL: http://www.szlcsc.com/product/details_54150.html; Package: 0805; Supplier: LC; SuppliersPartNumber: C53134
C146 = 0603 68nF (683) 10% 50V: 贴片电容; ComponentLink1Description: 供应商链接; ComponentLink1URL: http://www.szlcsc.com/product/details_32617.html; Package: 0603; Supplier: LC; SuppliersPartNumber: C31658
C149-C152 = 0805 100nF(104) 10% 50V: 贴片电容; ComponentLink1Description: 供应商链接; ComponentLink1URL: http://www.szlcsc.com/product/details_50686.html; Package: 0805; Supplier: LC; SuppliersPartNumber: C49678
L6 = Inductor: Code_IEC: 1005; Published: 8-Jun-2000; LatestRevisionDate: 29-May-2009; LatestRevisionNote: IPC-7351 Footprint Added.; PackageReference: 0402-A; Publisher: Altium Limited; PackageDescription: Chip Inductor; Code_JEITA: 0402
R88 R89 = 0402 0Ω (0R0) 1%: 贴片电阻; ComponentLink1Description: 供应商链接; ComponentLink1URL: http://www.szlcsc.com/product/details_17853.html; Package: 0402; Supplier: LC; SuppliersPartNumber: C17168
R90 = 0402 100Ω (1000) 1%: 贴片电阻; ComponentLink1Description: 供应商链接; ComponentLink1URL: http://www.szlcsc.com/product/details_25819.html; Package: 0402; Supplier: LC; SuppliersPartNumber: C25076
R91 R92 = 0402 2KΩ (2001) 1%: 贴片电阻; ComponentLink1Description: 供应商链接; ComponentLink1URL: http://www.szlcsc.com/product/details_4516.html; Package: 0402; Supplier: LC; SuppliersPartNumber: C4109
R93 = 0402 120KΩ (1203) 1%: 贴片电阻; ComponentLink1Description: 供应商链接; ComponentLink1URL: http://www.szlcsc.com/product/details_26493.html; Package: 0402; Supplier: LC; SuppliersPartNumber: C25750
R94 = 0402 5.1KΩ (5101) 1%: 贴片电阻; ComponentLink1Description: 供应商链接; ComponentLink1URL: http://www.szlcsc.com/product/details_26648.html; Package: 0402; Supplier: LC; SuppliersPartNumber: C25905
R95-R100 R102 R104 R106-R108 = 0805 0Ω (0R0) 1%: 贴片电阻; ComponentLink1Description: 供应商链接; ComponentLink1URL: http://www.szlcsc.com/product/details_18165.html; Package: 0805; Supplier: LC; SuppliersPartNumber: C17477
R101 R103 R105 = 0805 49.9Ω (49R9) 1%: 贴片电阻; ComponentLink1Description: 供应商链接; ComponentLink1URL: http://www.szlcsc.com/product/details_18408.html; Package: 0805; Supplier: LC; SuppliersPartNumber: C17720
U16 = AD9516-4BCPZ-REEL7: 时钟分配芯片; Manufacturer: ADI(亚德诺); Add into BOM: yes; Output Frequency(Max): 2.4GHz; Voltage - Supply: 3.135V~3.465V; Number of Outputs: 10; Input Low Voltage: 800mV; Intput High Voltage: 2V; Symbol: AD9516-4BCPZ-REEL7; Device: AD9516-4BCPZ-REEL7; LCSC Part Name: 14-具有集成1.6 GHz VCO的输出时钟发生器; Supplier Part: C653502; Manufacturer Part: AD9516-4BCPZ-REEL7; Supplier Footprint: LFCSP-64(9x9); JLCPCB Part Class: Extended Part; Datasheet: https://atta.szlcsc.com/upload/public/pdf/source/20220408/79BD7CFE6E0B71D46ED75CF470DA5615.pdf; Supplier: LCSC; Convert to PCB: yes; Operating Temperature: -40℃~+85℃
U17 = RT9193-33: 3.3v低压差稳压芯片
VCO1 = MAX2608: 300MHz~500MHz VCO
X2 = SX3DF100.000B20F30PNN: 3225有源差分晶体; Manufacturer: SCTF(星通时频); Add into BOM: yes; Normal temperature Frequency Tolerance: ±20ppm; Output Type: LVPECL; Voltage - Supply: 3.3V; Current - Supply: 50mA; Symbol: SX3DF100.000B20F30PNN; Device: SX3DF100.000B20F30PNN; LCSC Part Name: 100MHz 3.3V ±20ppm LVPECL; Supplier Part: C5830670; Manufacturer Part: SX3DF100.000B20F30PNN; Supplier Footprint: SMD3225-6P; JLCPCB Part Class: Extended Part; Datasheet: https://item.szlcsc.com/datasheet/SX3DF100.000B20F30PNN/6761487.html; Supplier: LCSC; Convert to PCB: yes; Value: 100MHz; Frequency Stability: ±20ppm; Operating Temperature: -40℃~+85℃

## Nets that join several sheets
GND: Cortex_M (84 pins), ZYNQ (154 pins), jtag (37 pins), power (113 pins), Risc_V (62 pins), AD9156 (29 pins)
IF_3V3: power (R52.1), Risc_V (41 pins)
VCC: Cortex_M (R7.1 U3.2 U3.7), jtag (R46.1 U11.2 U11.7), power (49 pins), Risc_V (C176.2 U21.2 U21.7 U22.5)
VCC_1V0: ZYNQ (27 pins), power (L2.3)
VCC_1V5: ZYNQ (40 pins), power (L4.3)
VCC_1V8: ZYNQ (34 pins), jtag (R30.2), power (L3.3)
VCC_3V3: ZYNQ (52 pins), jtag (18 pins), power (L5.3)
VCC_5V: Cortex_M (C15.2 U4.1 U4.3), power (5 pins), Risc_V (5 pins), AD9156 (C141.2 U17.1 U17.3)
CSn: Cortex_M (U1#1.T14), AD9156 (U16.17)
JTAG_TCK: ZYNQ (U5.F9), jtag (R38.2)
JTAG_TDI: ZYNQ (U5.G6), jtag (R37.2)
JTAG_TDO: ZYNQ (U5.F6), jtag (R36.2)
JTAG_TMS: ZYNQ (U5.J6), jtag (R35.2)
LD: Cortex_M (U1#1.D15), AD9156 (U16.3)
PC13: Cortex_M (U1#1.E3), Risc_V (U19.8)
PDn: Cortex_M (U1#1.T16), AD9156 (U16.24)
PSU1_RXD: ZYNQ (U5.C5), Risc_V (U19.62)
PSU1_TXD: ZYNQ (U5.C8), Risc_V (U19.61)
PSU2_RXD: ZYNQ (U5.D9), Risc_V (U19.66)
PSU2_TXD: ZYNQ (U5.E8), Risc_V (U19.65)
REF_SEL: Cortex_M (U1#1.B17), AD9156 (U16.7)
REFMON: Cortex_M (U1#1.D16), AD9156 (U16.2)
RESETn: Cortex_M (U1#1.U16), power (R51.1), AD9156 (U16.23)
SCLK: Cortex_M (U1#1.U14), AD9156 (U16.16)
SDIO: Cortex_M (U1#1.T15), AD9156 (U16.22)
SDO: Cortex_M (U1#1.U15), AD9156 (U16.21)
STATUS: Cortex_M (U1#1.C15), AD9156 (U16.6)
SYNCn: Cortex_M (U1#1.B16), AD9156 (U16.8)
U5_RX: Cortex_M (U1#1.P11), Risc_V (U19.1)
U5_TX: Cortex_M (U1#1.P12), Risc_V (U19.2)
U8_RX: Cortex_M (U1#1.N3), Risc_V (U19.17)
U8_TX: Cortex_M (U1#1.U2), Risc_V (U19.18)